# EasyEDA schematic 1-Schematic_OProROMDisk.json
TITLE: Orion-Pro ROM-Disk; REV: 1.0; Date: 2020-08-24; Sheet: 1/1; Drawn By: romychs_4693; Company: zx-pk.ru
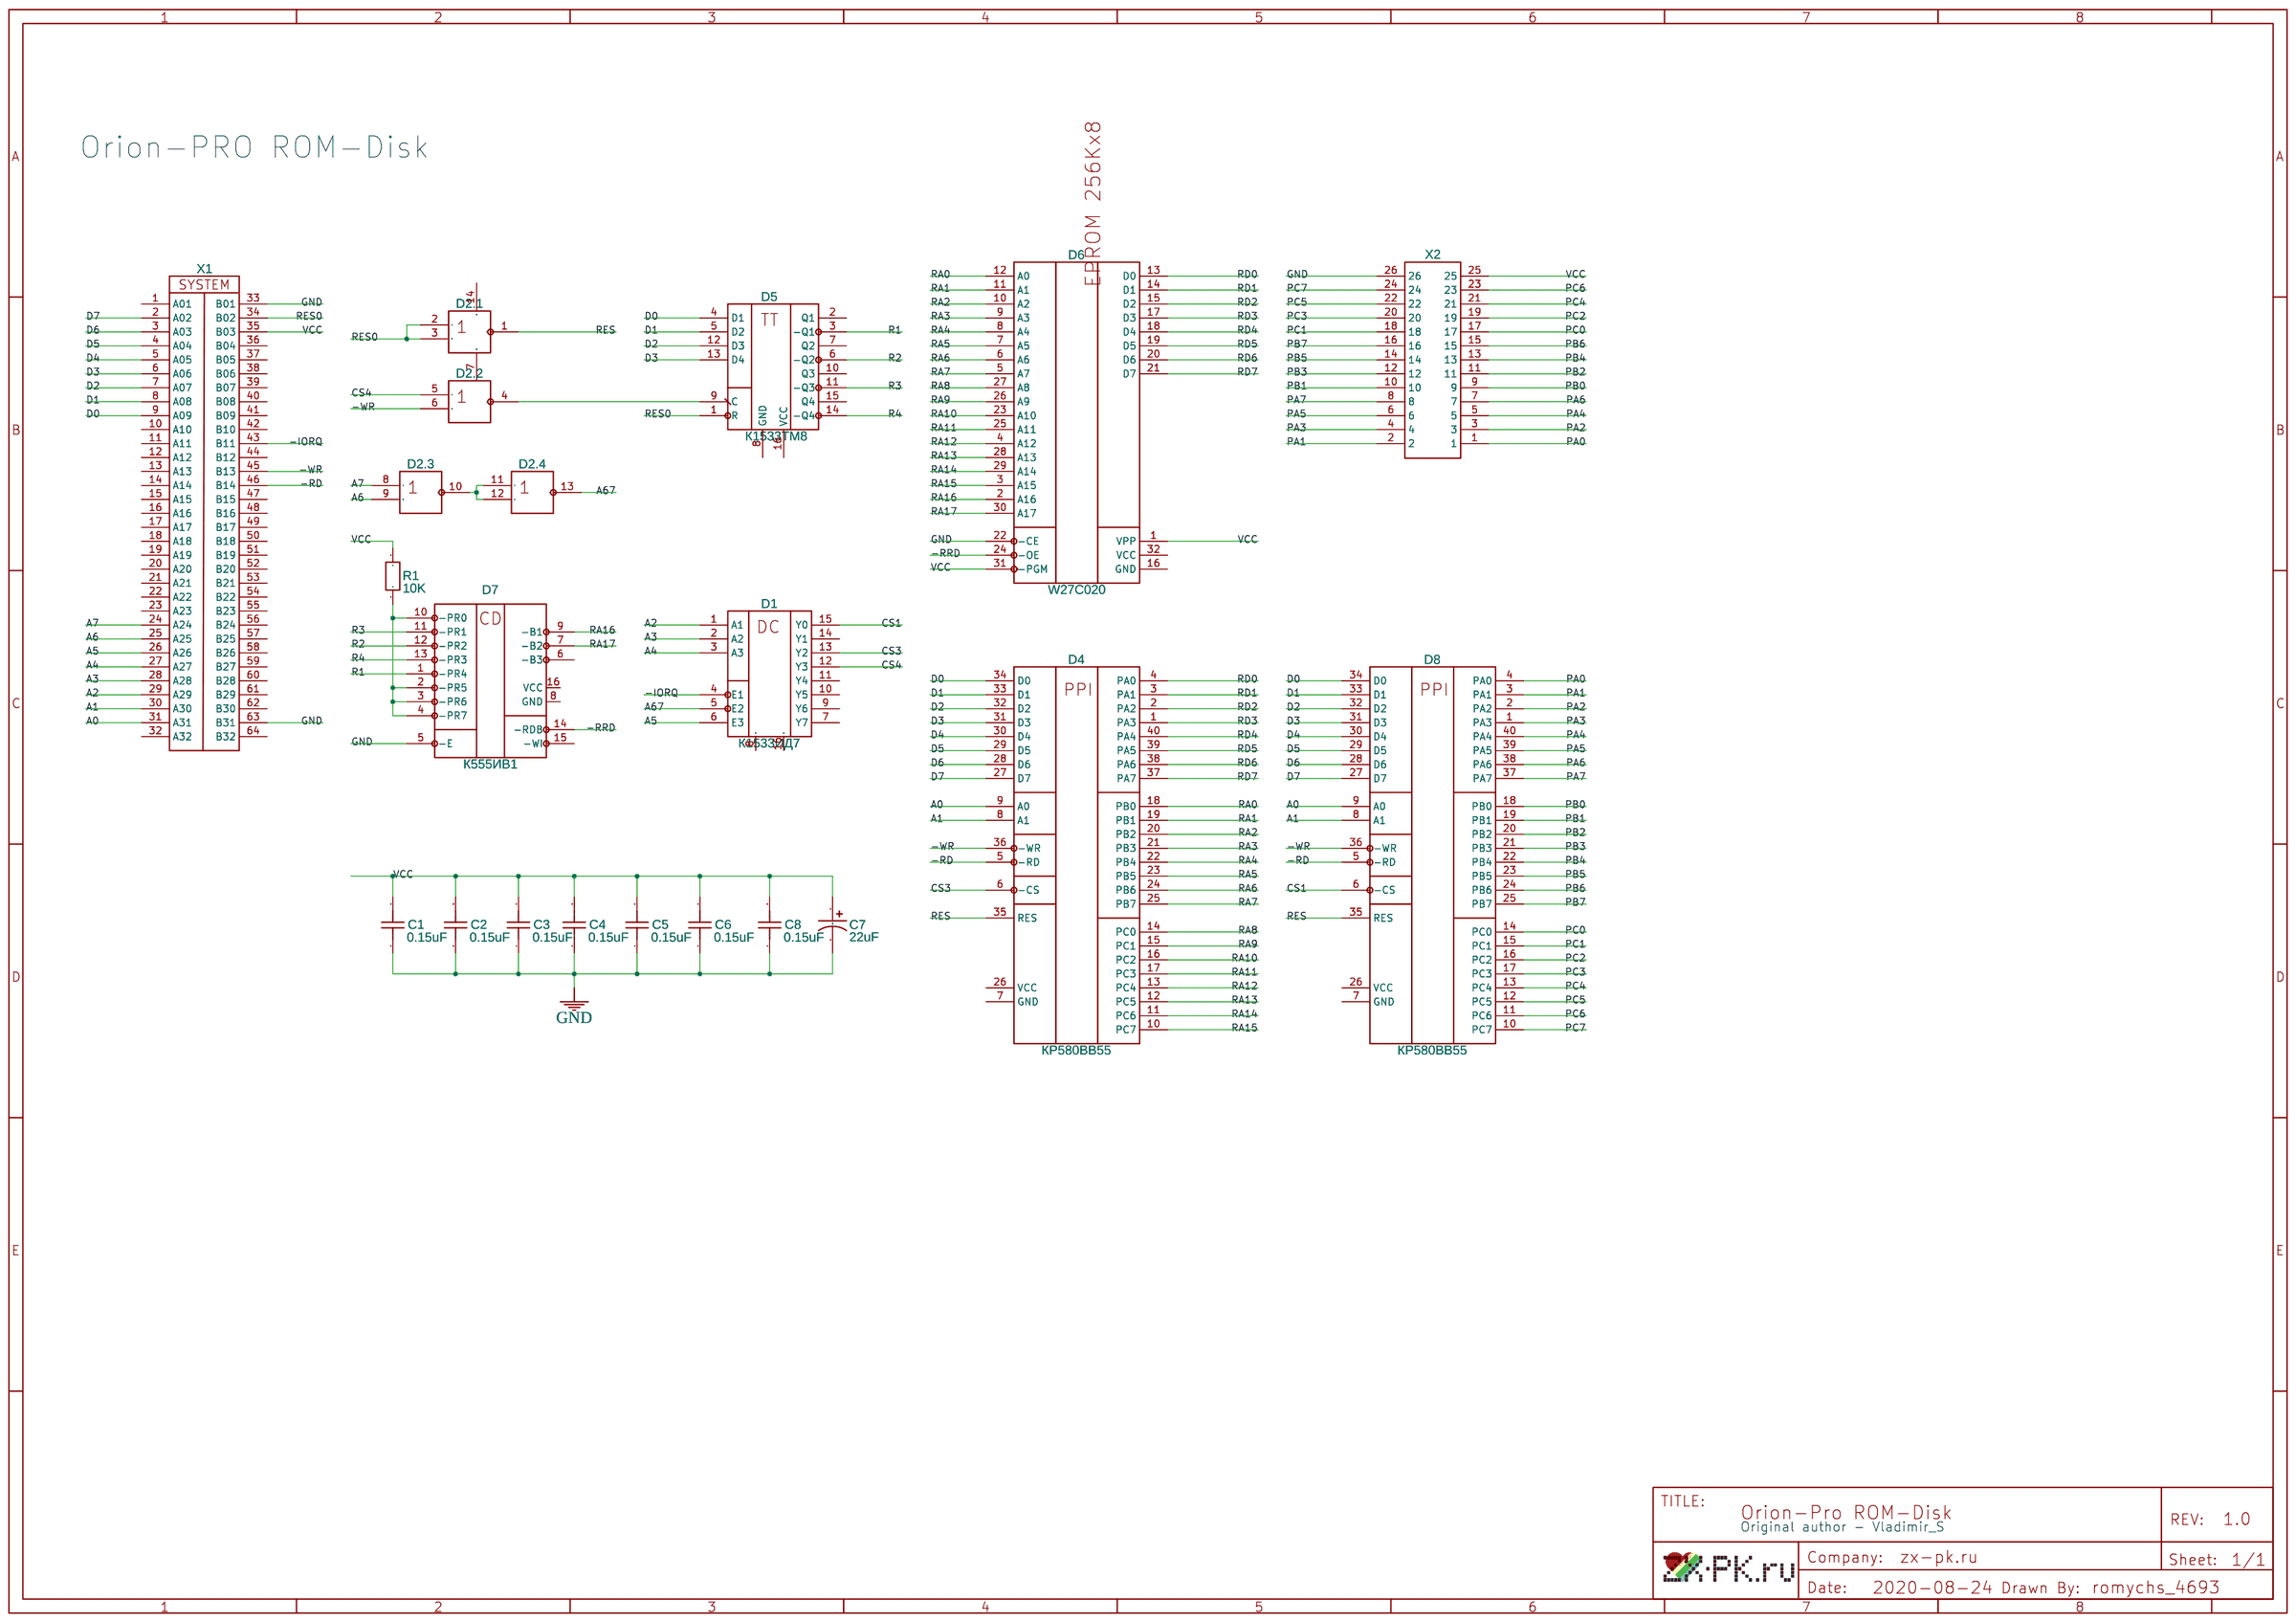
[diagram p0: schematic sheet]

## Parts
C1  0.15uF  [CAP-TH_L3.0-W2.0-P2.54-D0.7]
C2  0.15uF  [CAP-TH_L3.0-W2.0-P2.54-D0.7]
C3  0.15uF  [CAP-TH_L3.0-W2.0-P2.54-D0.7]
C4  0.15uF  [CAP-TH_L3.0-W2.0-P2.54-D0.7]
C5  0.15uF  [CAP-TH_L3.0-W2.0-P2.54-D0.7]
C6  0.15uF  [CAP-TH_L3.0-W2.0-P2.54-D0.7]
C7  22uF  [CAP-TH_BD1.0-P2.54-D6.3-FD]
C8  0.15uF  [CAP-TH_L3.0-W2.0-P2.54-D0.7]
D1  К1533ИД7  [DIP-16_L19.8-W6.5-P2.54-LS7.6-BL]
D2  К1533ЛЕ1  [DIP-14_L20.0-W7.6-P2.54-LS8.0-BL]  (sections 1,2,3,4)
D4  КР580ВВ55  [DIP-40_L50.8-W17.8-P2.54-LS15.2-BL]
D5  К1533ТМ8  [DIP-16_L19.8-W6.5-P2.54-LS7.6-BL]
D6  W27C020  [DIP-32_L40.9-W17.8-P2.54-LS17.8-BL]
D7  К555ИВ1  [DIP-16_L19.8-W6.5-P2.54-LS7.6-BL]
D8  КР580ВВ55  [DIP-40_L50.8-W17.8-P2.54-LS15.2-BL]
R1  10K  [R_0.125_7.62]
X1  SysConnOPro-32x2  [SYS_CONN_OPRO_32X2]
X2  Z-231011826106  [IDC-TH_Z-231011826106]

## Library data of the parts
C1-C6 C8 = CK45-R3AD152K-VRY: Supplier: LCSC; Supplier Part: C340608; Manufacturer: TDK; Contributor: LCSC
C7 = 400AX22MEFC12.5X16: Supplier: LCSC; Supplier Part: C473193; Manufacturer: Rubycon; Contributor: LCSC
D1 = К1533ИД7: Supplier: chipdip; Contributor: romychs_4693; subpart_no: 4
D2 = К1533ЛЕ1: Supplier: chipdip; Contributor: Roman Boykov; subpart_no: 1
D4 D8 = КР580ВВ55: Supplier: chipdip; Contributor: romychs_4693
D5 = К1533ТМ8: Supplier: chipdip; Contributor: Roman Boykov
D6 = W27C020: Supplier: chipdip; Contributor: Roman Boykov
D7 = К555ИВ1: Supplier: chipdip; Contributor: romychs_4693
R1 = RN 1/8W 10K F T/B A1: Supplier: LCSC; Supplier Part: C433502; Manufacturer: TyoHM; Contributor: LCSC
X1 = SysConnOPro-32x2: Supplier: chipdip; Contributor: Roman Boykov
X2 = Z-231011826106: Supplier: LCSC; Supplier Part: C221065; Manufacturer: Nextronics Engineering; Contributor: LCSC

## Nets
GND: C1.1 C2.1 C3.1 C4.1 C5.1 C6.1 C7.2 C8.1 D6.22(-CE) D7.5(-E) X1.33(B01) X1.63(B31) X2.26
VCC: C1.2 C2.2 C3.2 C4.2 C5.2 C6.2 C7.1 C8.2 D6.1(VPP) D6.31(-PGM) R1.2 X1.35(B03) X2.25
-IORQ: D1.4(E1) X1.43(B11)
-RD: D4.5(-RD) D8.5(-RD) X1.46(B14)
-RRD: D6.24(-OE) D7.14(-RDB)
-WR: D2.6(2) D4.36(-WR) D8.36(-WR) X1.45(B13)
A0: D4.9(A0) D8.9(A0) X1.31(A31)
A1: D4.8(A1) D8.8(A1) X1.30(A30)
A2: D1.1(A1) X1.29(A29)
A3: D1.2(A2) X1.28(A28)
A4: D1.3(A3) X1.27(A27)
A5: D1.6(E3) X1.26(A26)
A6: D2.9(2) X1.25(A25)
A7: D2.8(1) X1.24(A24)
A67: D1.5(E2) D2.13(3)
CS1: D1.15(Y0) D8.6(-CS)
CS3: D1.13(Y2) D4.6(-CS)
CS4: D1.12(Y3) D2.5(1)
D0: D4.34(D0) D5.4(D1) D8.34(D0) X1.9(A09)
D1: D4.33(D1) D5.5(D2) D8.33(D1) X1.8(A08)
D2: D4.32(D2) D5.12(D3) D8.32(D2) X1.7(A07)
D3: D4.31(D3) D5.13(D4) D8.31(D3) X1.6(A06)
D4: D4.30(D4) D8.30(D4) X1.5(A05)
D5: D4.29(D5) D8.29(D5) X1.4(A04)
D6: D4.28(D6) D8.28(D6) X1.3(A03)
D7: D4.27(D7) D8.27(D7) X1.2(A02)
PA0: D8.4(PA0) X2.1
PA1: D8.3(PA1) X2.2
PA2: D8.2(PA2) X2.3
PA3: D8.1(PA3) X2.4
PA4: D8.40(PA4) X2.5
PA5: D8.39(PA5) X2.6
PA6: D8.38(PA6) X2.7
PA7: D8.37(PA7) X2.8
PB0: D8.18(PB0) X2.9
PB1: D8.19(PB1) X2.10
PB2: D8.20(PB2) X2.11
PB3: D8.21(PB3) X2.12
PB4: D8.22(PB4) X2.13
PB5: D8.23(PB5) X2.14
PB6: D8.24(PB6) X2.15
PB7: D8.25(PB7) X2.16
PC0: D8.14(PC0) X2.17
PC1: D8.15(PC1) X2.18
PC2: D8.16(PC2) X2.19
PC3: D8.17(PC3) X2.20
PC4: D8.13(PC4) X2.21
PC5: D8.12(PC5) X2.22
PC6: D8.11(PC6) X2.23
PC7: D8.10(PC7) X2.24
R1: D5.3(-Q1) D7.1(-PR4)
R2: D5.6(-Q2) D7.12(-PR2)
R3: D5.11(-Q3) D7.11(-PR1)
R4: D5.14(-Q4) D7.13(-PR3)
RA0: D4.18(PB0) D6.12(A0)
RA1: D4.19(PB1) D6.11(A1)
RA2: D4.20(PB2) D6.10(A2)
RA3: D4.21(PB3) D6.9(A3)
RA4: D4.22(PB4) D6.8(A4)
RA5: D4.23(PB5) D6.7(A5)
RA6: D4.24(PB6) D6.6(A6)
RA7: D4.25(PB7) D6.5(A7)
RA8: D4.14(PC0) D6.27(A8)
RA9: D4.15(PC1) D6.26(A9)
RA10: D4.16(PC2) D6.23(A10)
RA11: D4.17(PC3) D6.25(A11)
RA12: D4.13(PC4) D6.4(A12)
RA13: D4.12(PC5) D6.28(A13)
RA14: D4.11(PC6) D6.29(A14)
RA15: D4.10(PC7) D6.3(A15)
RA16: D6.2(A16) D7.9(-B1)
RA17: D6.30(A17) D7.7(-B2)
RD0: D4.4(PA0) D6.13(D0)
RD1: D4.3(PA1) D6.14(D1)
RD2: D4.2(PA2) D6.15(D2)
RD3: D4.1(PA3) D6.17(D3)
RD4: D4.40(PA4) D6.18(D4)
RD5: D4.39(PA5) D6.19(D5)
RD6: D4.38(PA6) D6.20(D6)
RD7: D4.37(PA7) D6.21(D7)
RES: D2.1(3) D4.35(RES) D8.35(RES)
RES0: D2.2(1) D2.3(2) D5.1(R) X1.34(B02)
Net-(D2.2-4): D2.4(3) D5.9(C)
Net-(D2.3-10): D2.10(3) D2.11(1) D2.12(2)
Net-(D7-2): D7.2(-PR5) D7.3(-PR6) D7.4(-PR7) D7.10(-PR0) R1.1

Not connected (* = marked no-connect by the designer): D1 7(Y7) 8(GND) 9(Y6) 10(Y5) 11(Y4) 14(Y1) 16(VCC); D2 7(GND) 14(VCC); D4 7(GND) 26(VCC); D5 2(Q1) 7(Q2) 8(GND) 10(Q3) 15(Q4) 16(VCC); D6 16(GND) 32(VCC); D7 6(-B3) 8(GND) 15(-WI) 16(VCC); D8 7(GND) 26(VCC); X1 1(A01) 10(A10) 11(A11) 12(A12) 13(A13) 14(A14) 15(A15) 16(A16) 17(A17) 18(A18) 19(A19) 20(A20) 21(A21) 22(A22) 23(A23) 32(A32) 36(B04) 37(B05) 38(B06) 39(B07) 40(B08) 41(B09) 42(B10) 44(B12) 47(B15) 48(B16) 49(B17) 50(B18) 51(B19) 52(B20) 53(B21) 54(B22) 55(B23) 56(B24) 57(B25) 58(B26) 59(B27) 60(B28) 61(B29) 62(B30) 64(B32)

## Notes on the sheet
- Orion-PRO ROM-Disk
- Original author - Vladimir_S
